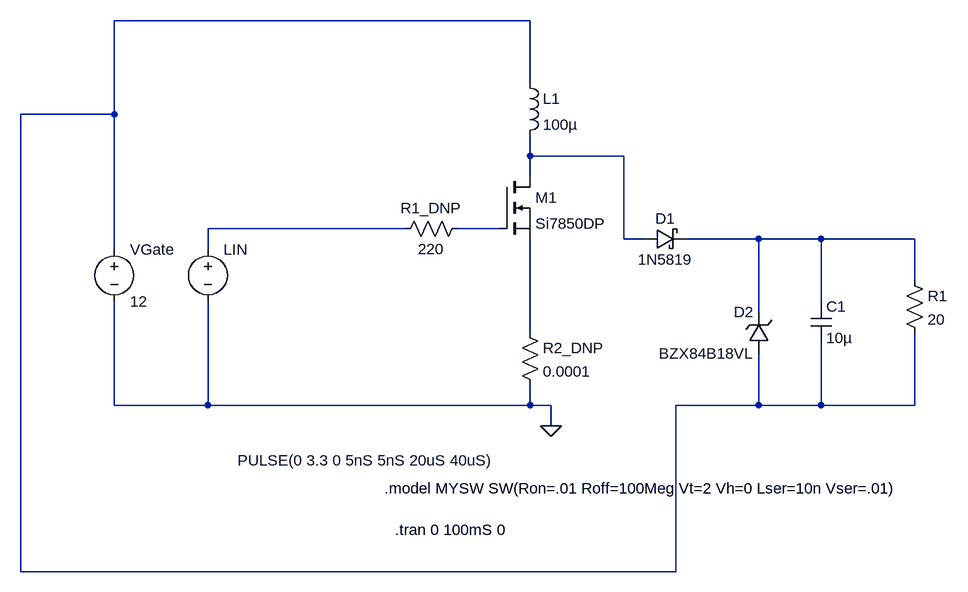
[diagram p0: schematic vgateh.asc]
vgateh.asc, the LTspice schematic file:
Version 4
SHEET 1 1304 680
WIRE 320 -256 -320 -256
WIRE 320 -160 320 -256
WIRE -320 -112 -320 -256
WIRE -320 -112 -464 -112
WIRE 320 -48 320 -80
WIRE 464 -48 320 -48
WIRE 320 -16 320 -48
WIRE 128 64 -176 64
WIRE 272 64 208 64
WIRE 464 80 464 -48
WIRE 496 80 464 80
WIRE 672 80 560 80
WIRE 768 80 672 80
WIRE 912 80 768 80
WIRE -320 96 -320 -112
WIRE -176 96 -176 64
WIRE 912 144 912 80
WIRE 768 176 768 80
WIRE 672 192 672 80
WIRE 320 224 320 80
WIRE -320 336 -320 176
WIRE -176 336 -176 176
WIRE -176 336 -320 336
WIRE 320 336 320 304
WIRE 320 336 -176 336
WIRE 352 336 320 336
WIRE 672 336 672 256
WIRE 672 336 544 336
WIRE 768 336 768 240
WIRE 768 336 672 336
WIRE 912 336 912 224
WIRE 912 336 768 336
WIRE 352 368 352 336
WIRE -464 592 -464 -112
WIRE 544 592 544 336
WIRE 544 592 -464 592
FLAG 352 368 0
SYMBOL voltage -320 80 R0
WINDOW 123 0 0 Left 2
WINDOW 39 0 0 Left 2
SYMATTR InstName VGate
SYMATTR Value 12
SYMBOL voltage -176 80 R0
WINDOW 3 46 341 Left 2
WINDOW 123 0 0 Left 2
WINDOW 39 0 0 Left 2
SYMATTR Value PULSE(0 3.3 0 5nS 5nS 20uS 40uS)
SYMATTR InstName LIN
SYMBOL res 112 80 R270
WINDOW 0 32 56 VTop 2
WINDOW 3 0 56 VBottom 2
SYMATTR InstName R1_DNP
SYMATTR Value 220
SYMBOL res 304 208 R0
SYMATTR InstName R2_DNP
SYMATTR Value 0.0001
SYMBOL res 896 128 R0
SYMATTR InstName R1
SYMATTR Value 20
SYMBOL nmos 272 -16 R0
SYMATTR InstName M1
SYMATTR Value Si7850DP
SYMBOL ind 304 -176 R0
SYMATTR InstName L1
SYMATTR Value 100µ
SYMATTR SpiceLine Ipk=0.2 Rser=4
SYMBOL schottky 496 96 R270
WINDOW 0 32 32 VTop 2
WINDOW 3 0 32 VBottom 2
SYMATTR InstName D1
SYMATTR Value 1N5819
SYMATTR Description Diode
SYMATTR Type diode
SYMBOL cap 752 176 R0
SYMATTR InstName C1
SYMATTR Value 10µ
SYMBOL zener 688 256 R180
WINDOW 0 24 64 Left 2
WINDOW 3 24 0 Left 2
SYMATTR InstName D2
SYMATTR Value BZX84B18VL
SYMATTR Description Diode
SYMATTR Type diode
TEXT 112 528 Left 2 !.tran 0 100mS 0
TEXT 96 464 Left 2 !.model MYSW SW(Ron=.01 Roff=100Meg Vt=2 Vh=0 Lser=10n Vser=.01)

The netlist it stands for:
* vgateh.asc
VGate N001 0 12
V§LIN N003 0 PULSE(0 3.3 0 5nS 5nS 20uS 40uS)
R1_DNP N003 N004 220
R2_DNP N006 0 0.0001
R1 N005 N001 20
M1 N002 N004 N006 N006 Si7850DP
L1 N001 N002 100µ Ipk=0.2 Rser=4
D1 N002 N005 1N5819
C1 N005 N001 10µ
D2 N001 N005 BZX84B18VL
.model D D
.lib standard.dio
.model NMOS NMOS
.model PMOS PMOS
.lib standard.mos
.tran 0 100mS 0
.model MYSW SW(Ron=.01 Roff=100Meg Vt=2 Vh=0 Lser=10n Vser=.01)
.backanno
.end